# EAGLE schematic BLUENRG-MS (EAGLE 9.2.1)
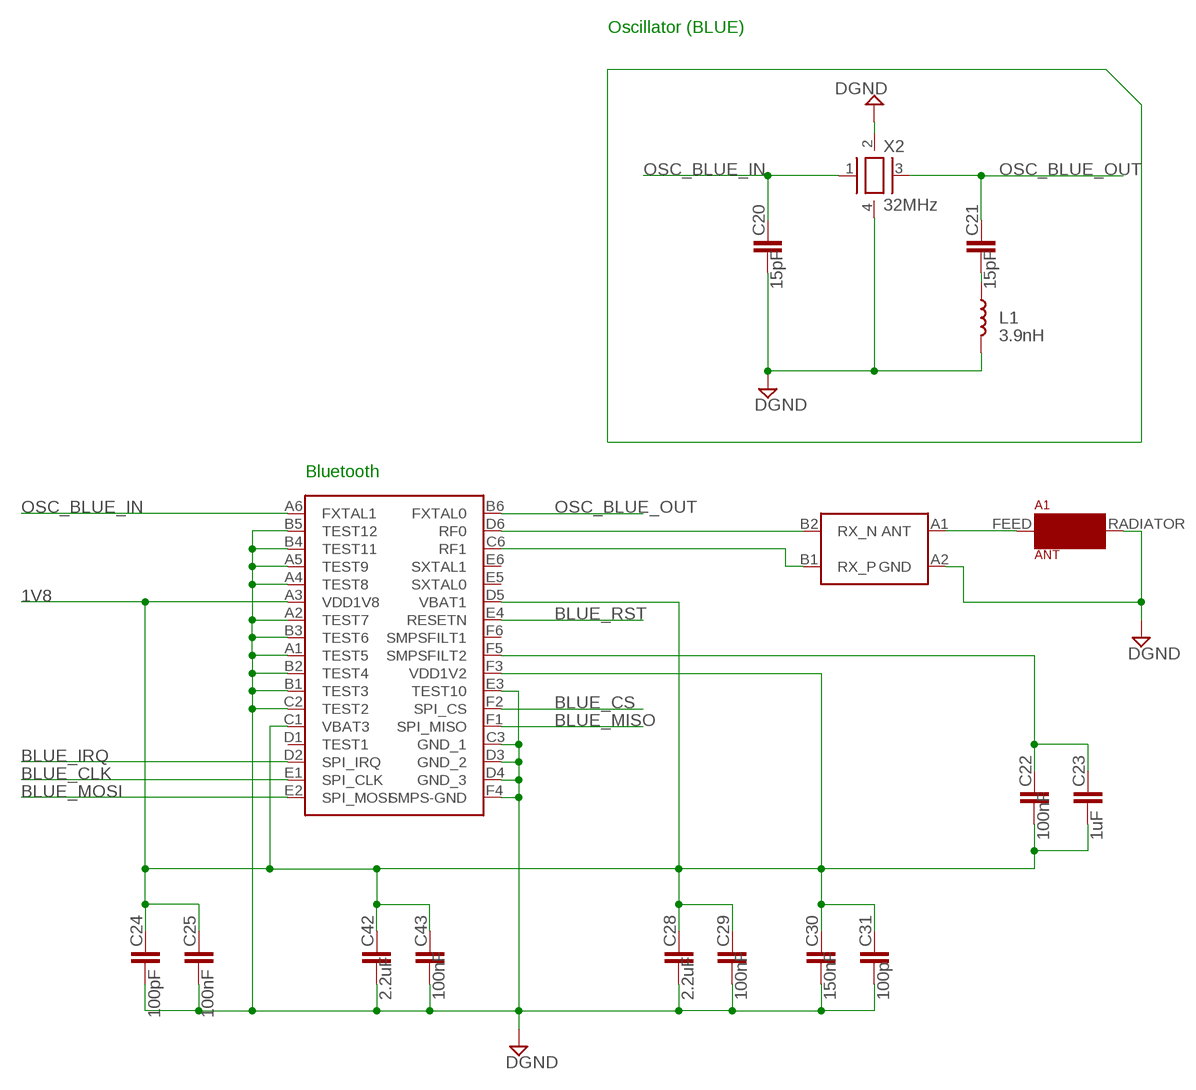
[diagram p0: schematic, sheet 1]

## Parts
A1  ANT  [ANTPACK]
C20  15pF  C_NP0603  [0201_X30]
C21  15pF  C_NP0603  [0201_X30]
C22  100nF  C_NP0603  [0201_X30]
C23  1uF  C_NP0603  [0201_X30]
C24  100pF  C_NP0603  [0201_X30]
C25  100nF  C_NP0603  [0201_X30]
C28  2.2uF  C_NP0603  [0201_X30]
C29  100nF  C_NP0603  [0201_X30]
C30  150nF  C_NP0603  [0201_X30]
C31  100p  C_NP0603  [0201_X30]
C42  2.2uF  C_NP0603  [0201_X30]
C43  100nF  C_NP0603  [0201_X30]
L1  3.9nH  L  [0201_X30]
L2  BALF-NRG-01D3  [FLIPCHIP]
U3  BLUENRG-MS  [WLCSP34]
X2  32MHz  ABM11W-101  [ABM11W-101]

## Nets
1V8: C22.2 C23.2 C24.1 C25.1 C28.1 C29.1 C30.1 C31.1 C42.1 C43.1 U3.A3(VDD1V8) U3.C1(VBAT3) U3.D5(VBAT1) U3.F3(VDD1V2)
BLUE_CLK: U3.E1(SPI_CLK)
BLUE_CS: U3.F2(SPI_CS)
BLUE_IRQ: U3.D2(SPI_IRQ)
BLUE_MISO: U3.F1(SPI_MISO)
BLUE_MOSI: U3.E2(SPI_MOSI)
BLUE_RST: U3.E4(RESETN)
DGND: A1.RADIATOR C20.2 C24.2 C25.2 C28.2 C29.2 C30.2 C31.2 C42.2 C43.2 L1.2 L2.A2(GND) U3.A1(TEST5) U3.A2(TEST7) U3.A4(TEST8) U3.A5(TEST9) U3.B1(TEST3) U3.B2(TEST4) U3.B3(TEST6) U3.B4(TEST11) U3.B5(TEST12) U3.C2(TEST2) U3.C3(GND_1) U3.D3(GND_2) U3.D4(GND_3) U3.E3(TEST10) U3.F4(SMPS-GND) X2.2 X2.4
N$2: C21.2 L1.1
N$12: A1.FEED L2.A1(ANT)
N$13: L2.B1(RX_P) U3.C6(RF1)
N$14: L2.B2(RX_N) U3.D6(RF0)
N$19: C22.1 C23.1 U3.F5(SMPSFILT2)
OSC_BLUE_IN: C20.1 U3.A6(FXTAL1) X2.1
OSC_BLUE_OUT: C21.1 U3.B6(FXTAL0) X2.3

## Notes on the sheet
- Oscillator (BLUE)
- Bluetooth

## Power pins joined to a net without a drawn wire
SMPSFILT1: U3.F6(SMPSFILT1)
SXTAL0: U3.E5(SXTAL0)
SXTAL1: U3.E6(SXTAL1)
TEST1: U3.D1(TEST1)

## Library data of the parts
A1 = OAlib:ANT
C20-C25 C28-C31 C42 C43 = OAlib:C_NP
L1 = OAlib:L: Fixed Inductors 0201 (0603mm) Source: Datasheet <https://componentsearchengine.com/Datasheets/1/LQP03TG0N6B02D.pdf>
L2 = OAlib:BALF-NRG-01D3
U3 = OAlib:BLUENRG-MS
X2 = OAlib:ABM11W-101: ABM11W-101-32.0000MHZ-T3